# Altium schematic sheet PWR_HT4928S.SchDoc
size A3; SheetNumber: 8; SheetTotal: 9
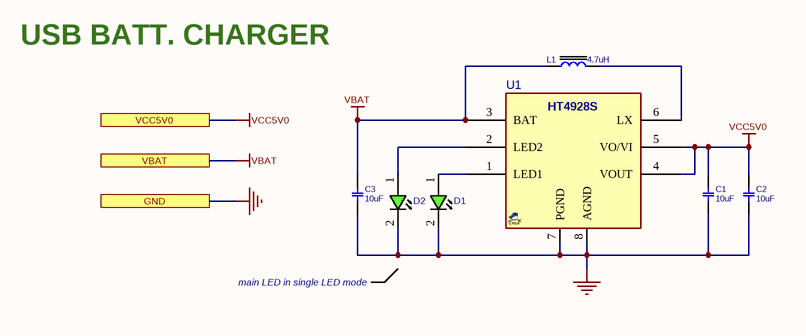
[diagram p0: PWR_HT4928S.SchDoc]

## Parts
C1  10uF  [C0402]
C2  10uF  [C0402]
C3  10uF  [C0402]
D1  LED603GRN  [LED0603GRN]  (value not drawn)
D2  LED603GRN  [LED0603GRN]  (value not drawn)
L1  4.7uH  [L_3]
U1  HT4928S  [SO_8]  (value not drawn)

## Ports
GND, VBAT, VCC5V0

## Nets
GND: C1.1 C2.1 C3.1 D1.2(CATHODE) D2.2(CATHODE) U1.7(PGND) U1.8(AGND) ; port GND
VBAT: C3.2 L1.1 U1.3(BAT) ; port VBAT
VCC5V0: C1.2 C2.2 U1.4(VOUT) U1.5(VO/VI) ; port VCC5V0
NetD1_1: D1.1(ANODE) U1.1(LED1)
NetD2_1: D2.1(ANODE) U1.2(LED2)
NetL1_2: L1.2 U1.6(LX)

## Notes on the sheet
- USB BATT. CHARGER
- main LED in single LED mode

## Library data of the parts
C1-C3 = CAP_SMD_MLCC: CAP, MLCC; PARAM: X5R, 20%; MANF_P#: CL05A106MP5NUNC; MANF: Samsung; PARAM2: 10v; PRICE: 10,000: $0.034; ASSEMBLY: ASSEMBLY; VALUE: 10uF
D1 D2 = LED_SMD_0603_GRN: LED, SMD, 0603, GREEN; PARAM: 20mA; MANF: Kingbright; DESC: DESCRIPTION; MANF_P#: APT1608SGC; PARAM2: 2.2V; ASSEMBLY: ASSEMBLY; PRICE: 1: 0.14$, 100: 6.8$; VALUE: LED603GRN
L1 = IND_SMD_2.2uH_2.6A: INDUCTOR; PARAM: 1A, -40~125oC; MANF_P#: NRH3012T4R7MN; MANF: Murata; PARAM2: 20%, 150mOhm; MANF_P#2: FNR3015S4R7MT; PRICE: 0.03$; ASSEMBLY: ASSEMBLY; VALUE: 4.7uH
U1 = HT4928S_SOP8: IC, CHARGER and Boost for USB mobile; MANF: HOTCHIP; PARAM: 0.8A, 1MHz, -40~85°C; MANF_P#: HT4928S; PARAM2: -; PRICE: 0.35$; VALUE: HT4928S; PACKAGE: SOP-8